# Altium schematic sheet 01_Index.SchDoc
size A4; SheetNumber: 1; SheetTotal: 3
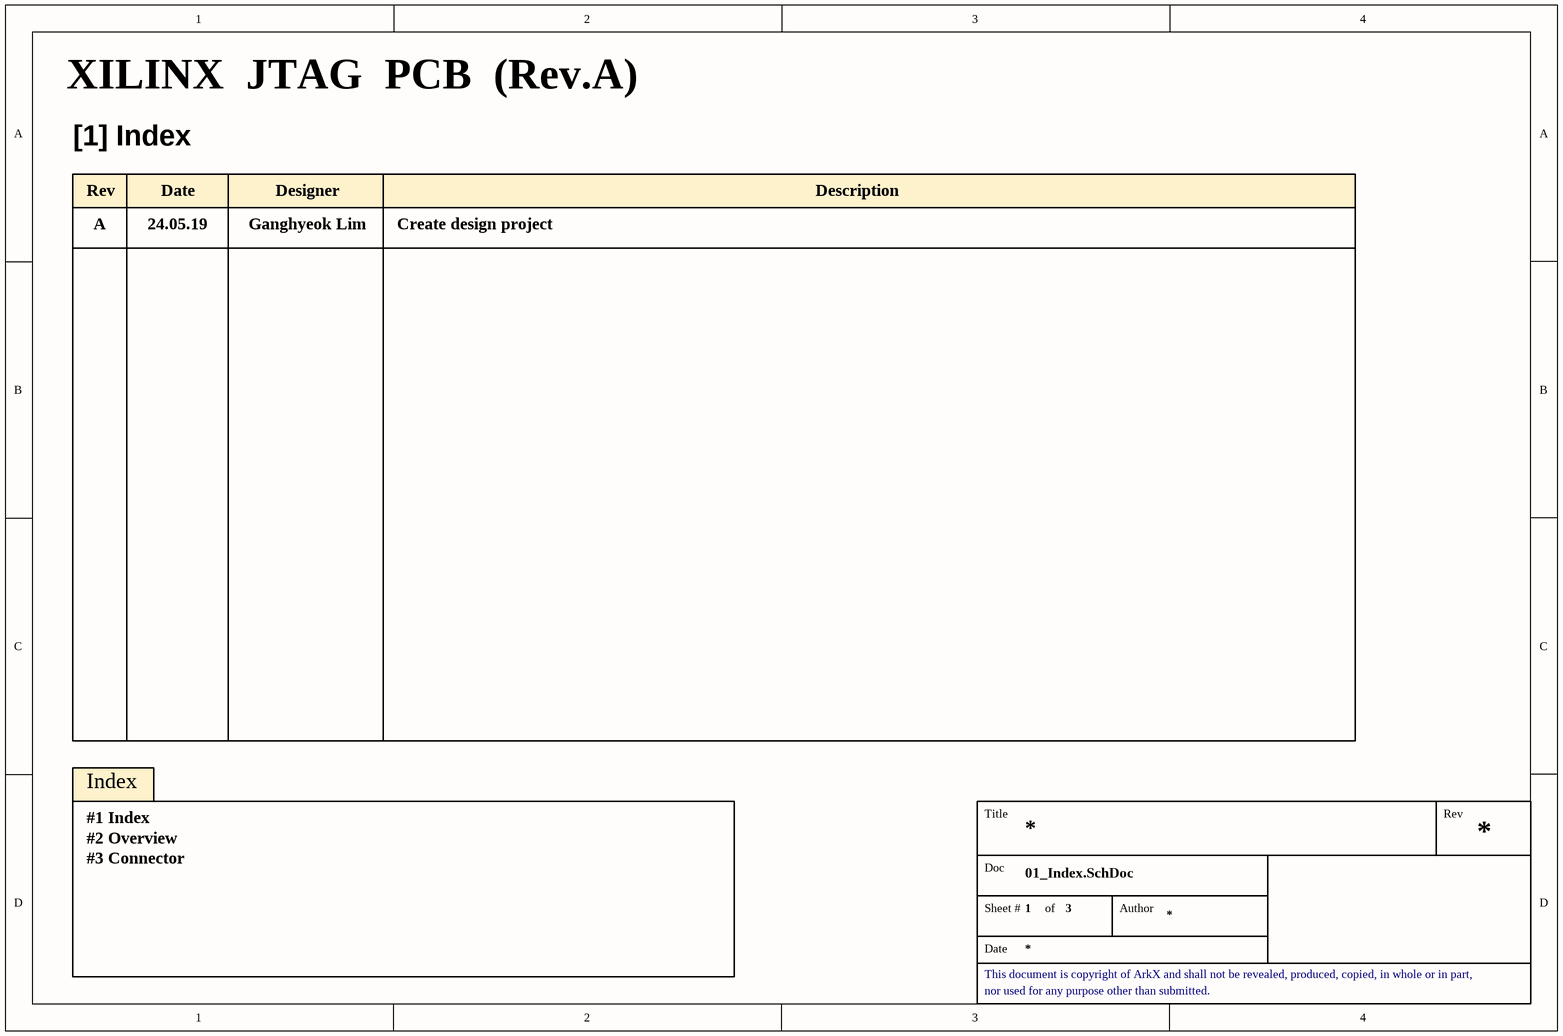
[diagram p0: 01_Index.SchDoc]

## Notes on the sheet
- XILINX  JTAG  PCB  (Rev.A)
- [1] Index
- Rev
- A
- 24.05.19
- Date
- Ganghyeok Lim
- Designer
- Create design project
- Description
- Index
- #1 Index
- #2 Overview
- #3 Connector
- Title
- Doc
- Sheet #
- of
- Author
- This document is copyright of ArkX and shall not be revealed, produced, copied, in whole or in part,
- nor used for any purpose other than submitted.